# Altium schematic sheet IR Detection.SchDoc
size A
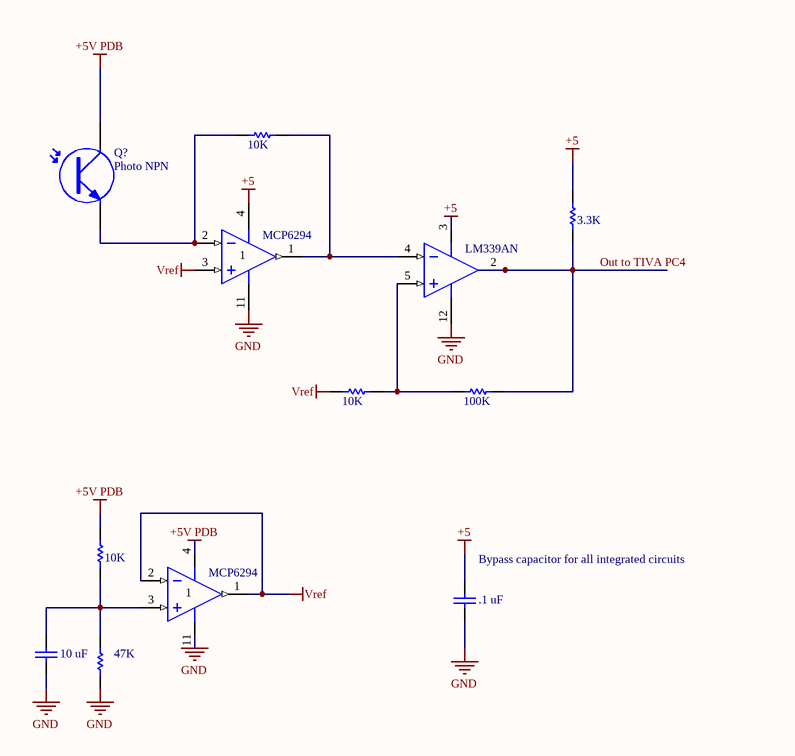
[diagram p0: IR Detection.SchDoc]

## Parts
(Parts that share a designator on the sheet are numbered #1, #2 ... from top to bottom, then left to right.)
C?#1  .1 uF  [RAD-0.3]
C?#2  10 uF  [RAD-0.3]
Q?  Photo NPN  [SFM-T2(3)/X1.6V]
R?#1  10K  [AXIAL-0.3]
R?#2  3.3K  [AXIAL-0.3]
R?#3  10K  [AXIAL-0.3]
R?#4  100K  [AXIAL-0.3]
R?#5  10K  [AXIAL-0.3]
R?#6  47K  [AXIAL-0.3]
U?#1  MCP6294  [DIP-14/D19.7]  (part A of 4)
U?#2  LM339AN  [DIP-14/D19.7]  (part A of 4)
U?#3  MCP6294  [DIP-14/D19.7]  (part A of 4)

## Nets
+5: C?#1.2 R?#2.1 U?#1.4(V+) U?#2.3(V+)
+5V PDB: Q?.1(C) R?#5.1 U?#3.4(V+)
GND: C?#1.1 C?#2.1 R?#6.2 U?#1.11(V-) U?#2.12(GND) U?#3.11(V-)
Vref: R?#3.2 U?#1.3(IN+) U?#3.1(OUT) U?#3.2(IN-)
Out to TIVA PC4: R?#2.2 R?#4.1 U?#2.2(OUT)
NetC?#2_2: C?#2.2 R?#5.2 R?#6.1 U?#3.3(IN+)
NetQ?_3: Q?.3(E) R?#1.1 U?#1.2(IN-)
NetR?#1_2: R?#1.2 U?#1.1(OUT) U?#2.4(IN-)
NetR?#3_1: R?#3.1 R?#4.2 U?#2.5(IN+)

## Notes on the sheet
- (near C?#1) Bypass capacitor for all integrated circuits

## Library data of the parts
C?#1 C?#2 = Cap: Capacitor; Manufacturer: Generic Components; Class: Passive; Value: 100pF; Published: 08/06/2000; Publisher: Altium Hobart Technology Centre; SubClass: Capacitor
Q? = Photo NPN: NPN Phototransistor; Manufacturer: Generic Components; Class: Optoelectronic; Published: 1999
R?#1 = Res1: Resistor; Manufacturer: Generic Components; Class: Passive; Published: 08/06/2000; Publisher: Altium Hobart Technology Centre; SubClass: Resistor
R?#2-R?#6 = Res1: Resistor; Manufacturer: Generic Components; Class: Passive; Value: 1K; Published: 08/06/2000; Publisher: Altium Hobart Technology Centre; SubClass: Resistor
U?#1 U?#3 = MCP6294: Quad 1Ma 10MHz Rail-to-Rail I/O Operational Amplifier; Manufacturer: National Semiconductor; Published: 15/04/2002; Publisher: Altium Hobart Technology Centre; Class: Amplifier; SubClass: Operational Amplifier
U?#2 = LM339AN: Quad Single-Supply Comparator; Manufacturer: Motorola; Class: Analog; Published: 15/04/2002; Publisher: Altium Hobart Technology Centre; SubClass: Comparator